# Altium schematic sheet Connector.SchDoc
size A; SheetNumber: 2; SheetTotal: 2
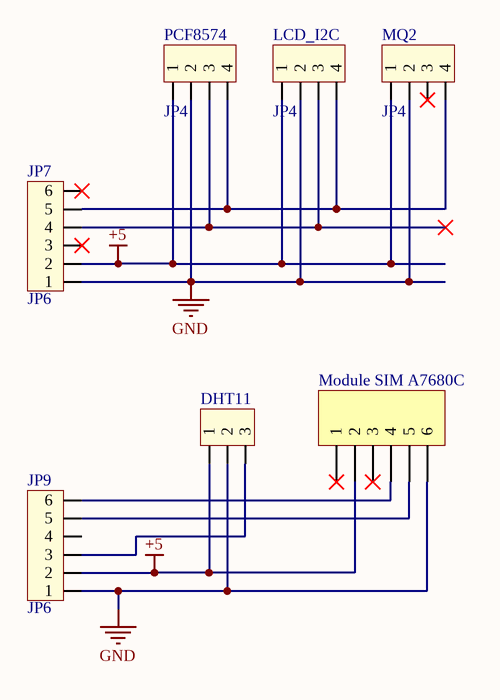
[diagram p0: Connector.SchDoc]

## Parts
DHT11  (no value)  [CON3]
JP7  JP6  [CON6]
JP9  JP6  [CON6]
LCD_I2C  JP4  [CON4]
Module_SIM_A7680C  (no value)  [Header 6]
MQ2  JP4  [CON4]
PCF8574  JP4  [CON4]

## Nets
+5: DHT11.1 JP7.2 JP9.2 LCD_I2C.1 Module_SIM_A7680C.2 MQ2.1 PCF8574.1
GND: DHT11.2 JP7.1 JP9.1 LCD_I2C.2 Module_SIM_A7680C.6 MQ2.2 PCF8574.2
NetDHT11_3: DHT11.3 JP9.3
NetJP7_4: JP7.4 LCD_I2C.3 PCF8574.3
NetJP7_5: JP7.5 LCD_I2C.4 MQ2.4 PCF8574.4
NetJP9_5: JP9.5 Module_SIM_A7680C.5
NetJP9_6: JP9.6 Module_SIM_A7680C.4

Not connected (* = marked no-connect by the designer): JP7 3* 6*; JP9 4; Module_SIM_A7680C 1* 3*; MQ2 3*

## Library data of the parts
DHT11 = Con3: Connector 3; Value: Connector 3
JP7 JP9 = Con6: Connector 6; Value: Connector 6
LCD_I2C MQ2 PCF8574 = Con4: Connector 4; Value: Connector 4
Module_SIM_A7680C = Header 6: Header, 6-Pin; LatestRevisionDate: 17-Jul-2002; LatestRevisionNote: Re-released for DXP Platform.; Publisher: Altium Limited